# EAGLE schematic gpi-filter1 (EAGLE 7.1.0)
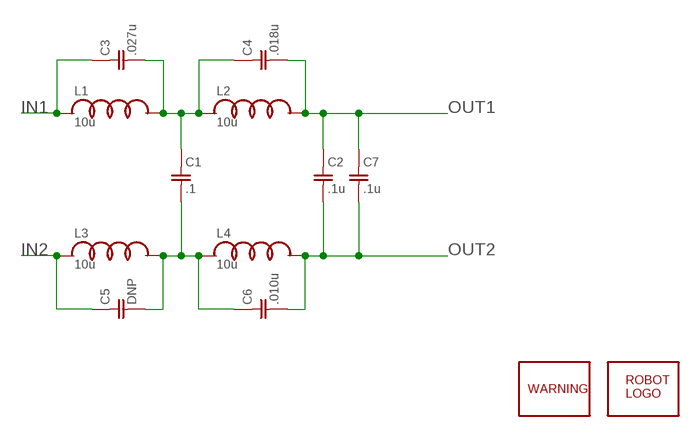
[diagram p0: schematic, sheet 1]

## Parts
C1  .1  C1210  [SMD1210]
C2  .1u  C1210  [SMD1210]
C3  .027u  C1210  [SMD1210]
C4  .018u  C1210  [SMD1210]
C5  DNP  C1210  [SMD1210]
C6  .010u  C1210  [SMD1210]
C7  .1u  C1210  [SMD1210]
L1  10u  LXAL10  [XAL10]
L2  10u  LXAL10  [XAL10]
L3  10u  LXAL10  [XAL10]
L4  10u  LXAL10  [XAL10]
U$1  ROBOTMAN-LOGO  [ROBOTMAN-LOGO]
U$2  SYMBOL-WARNING  [SYMBOL-WARNING]

## Nets
IN1: C3.1 L1.P$1
IN2: C5.1 L3.P$1
N$1: C1.1 C3.2 C4.1 L1.P$2 L2.P$1
N$4: C1.2 C5.2 C6.1 L3.P$2 L4.P$1
OUT1: C2.1 C4.2 C7.1 L2.P$2
OUT2: C2.2 C6.2 C7.2 L4.P$2

## Library data of the parts
C1-C7 = jaw:C
L1-L4 = jaw:L
U$1 = jaw:ROBOTMAN-LOGO
U$2 = jaw:SYMBOL-WARNING